# EAGLE design Bubble_Display_Controller (EAGLE 6.5.0)
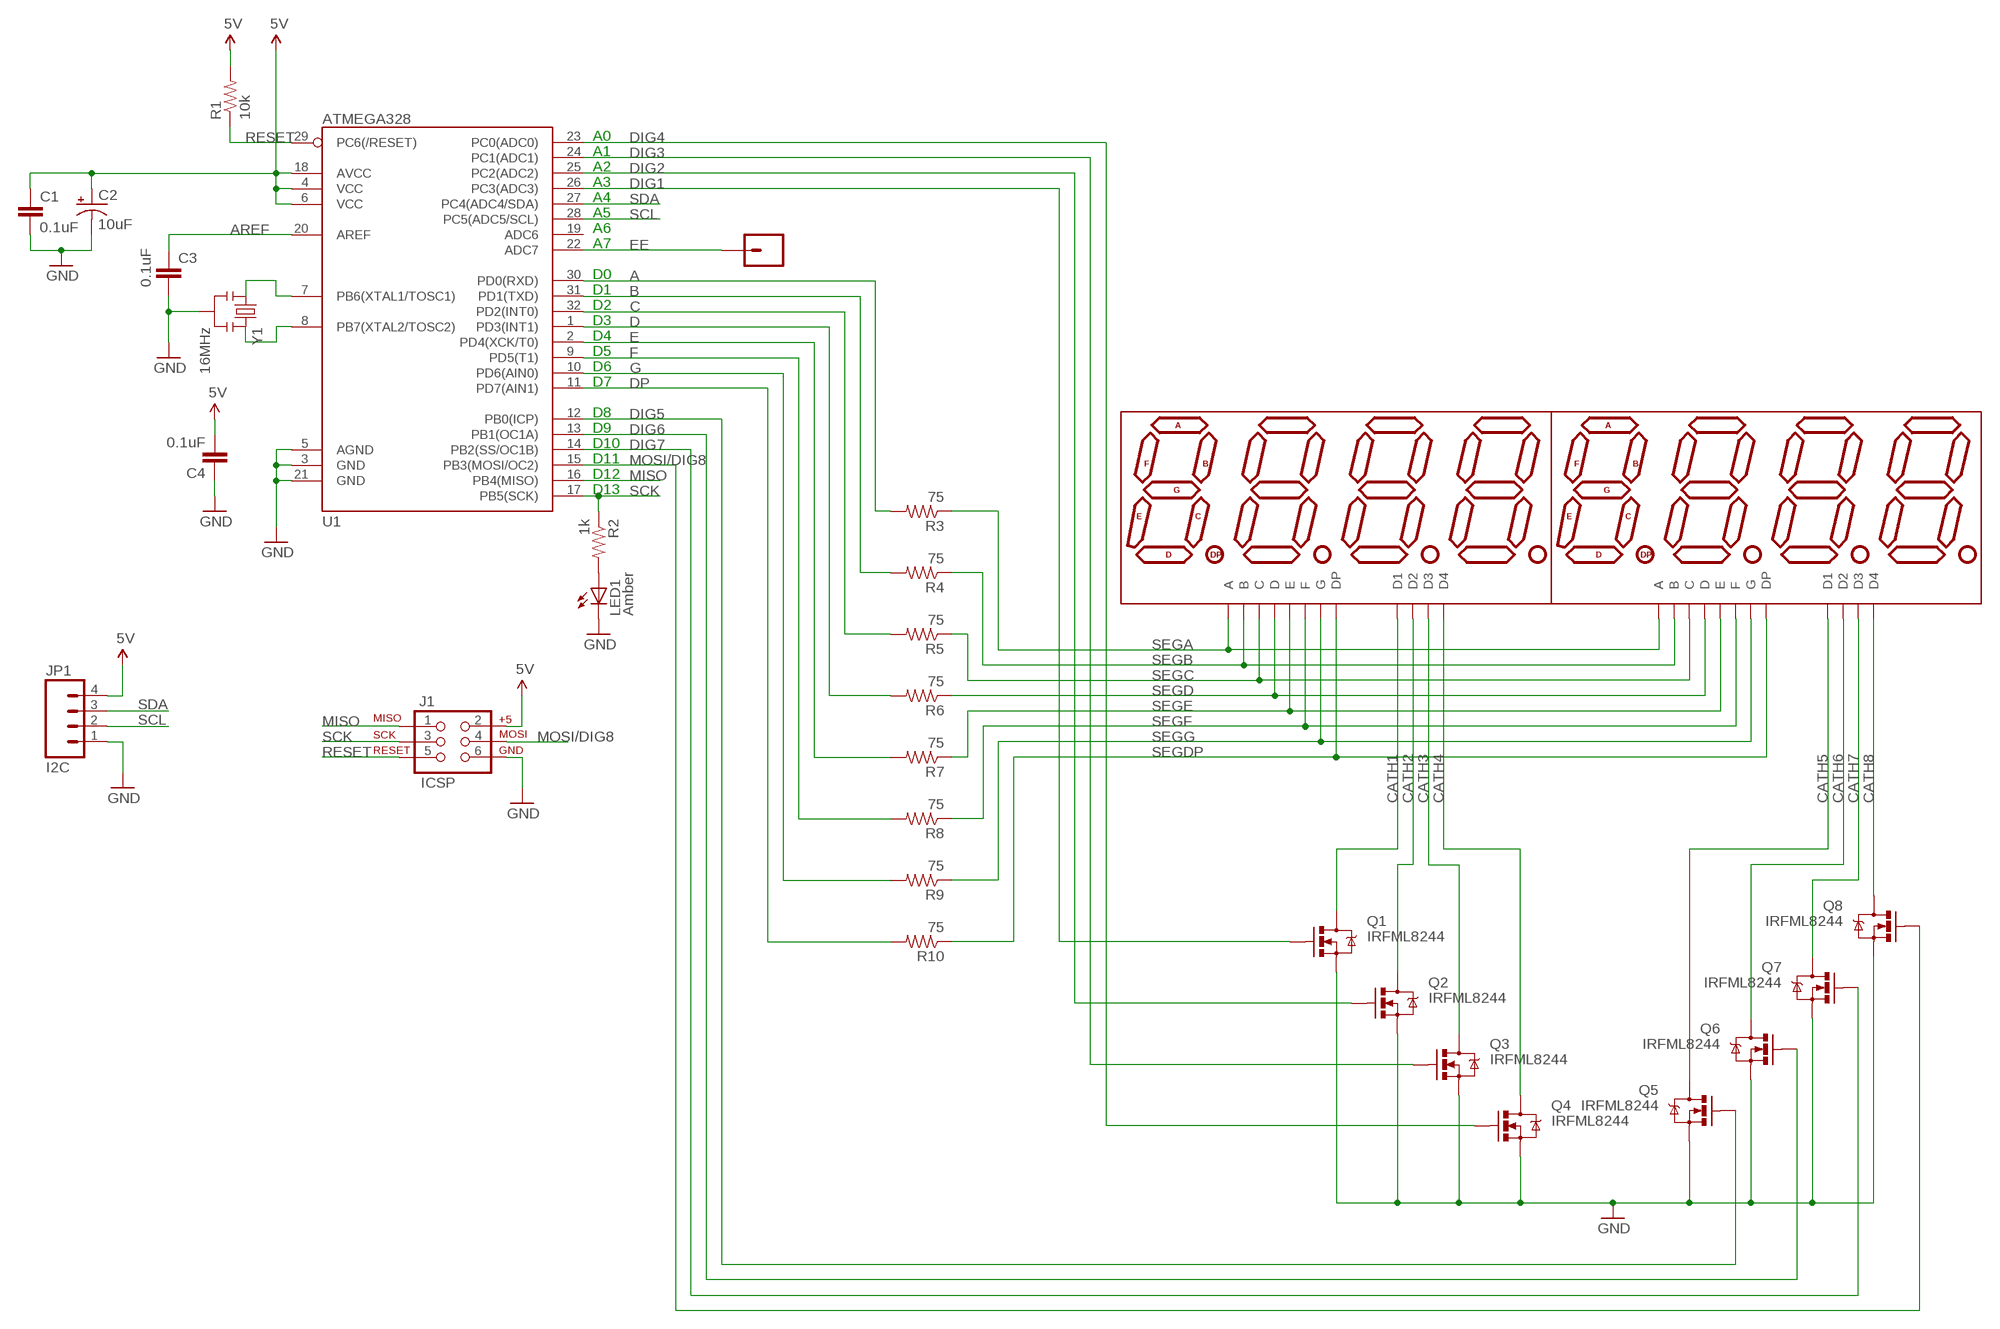
[diagram p0: schematic, sheet 1]

## Parts
C1  0.1uF  CAP0805  [0805]
C2  10uF  CAP_POL0805  [0805-POL]
C3  0.1uF  CAP0805  [0805]
C4  0.1uF  CAP0805  [0805]
DISPLAY1  hp  7-SEGMENT-4DIGIT-COUNTER-HP-BUBBLE  [DIL12]
DISPLAY2  hp  7-SEGMENT-4DIGIT-COUNTER-HP-BUBBLE  [DIL12]
J1  ICSP  AVR_SPI_PRG_6PTH  [2X3]
JP1  I2C  M04PTH  [1X04]
JP2  BREADBD_VIA  [BBD-VIA]
LED1  Amber  LED-0805  [0805-LED]
Q1  IRFML8244  MOSFET-NCHANNELBSS123LT1G  [SOT23]
Q2  IRFML8244  MOSFET-NCHANNELBSS123LT1G  [SOT23]
Q3  IRFML8244  MOSFET-NCHANNELBSS123LT1G  [SOT23]
Q4  IRFML8244  MOSFET-NCHANNELBSS123LT1G  [SOT23]
Q5  IRFML8244  MOSFET-NCHANNELBSS123LT1G  [SOT23]
Q6  IRFML8244  MOSFET-NCHANNELBSS123LT1G  [SOT23]
Q7  IRFML8244  MOSFET-NCHANNELBSS123LT1G  [SOT23]
Q8  IRFML8244  MOSFET-NCHANNELBSS123LT1G  [SOT23]
R1  10k  RESISTOR0805-RES  [0805]
R2  1k  RESISTOR0805-RES  [0805]
R3  75  RESISTOR0805-RES  [0805]
R4  75  RESISTOR0805-RES  [0805]
R5  75  RESISTOR0805-RES  [0805]
R6  75  RESISTOR0805-RES  [0805]
R7  75  RESISTOR0805-RES  [0805]
R8  75  RESISTOR0805-RES  [0805]
R9  75  RESISTOR0805-RES  [0805]
R10  75  RESISTOR0805-RES  [0805]
U1  ATMEGA328  ATMEGA168  [TQFP32-08]
Y1  16MHz  RESONATORSMD  [RESONATOR-SMD]

## Nets
5V: C1.1 C2.1(+) C4.2 J1.2 JP1.4 R1.2 U1.4(VCC) U1.6(VCC) U1.18(AVCC)
A: R3.2 U1.30(PD0(RXD))
AREF: C3.1 U1.20(AREF)
B: R4.2 U1.31(PD1(TXD))
C: R5.2 U1.32(PD2(INT0))
CATH1: DISPLAY1.1(D1) Q1.3(D)
CATH2: DISPLAY1.10(D2) Q2.3(D)
CATH3: DISPLAY1.4(D3) Q3.3(D)
CATH4: DISPLAY1.6(D4) Q4.3(D)
CATH5: DISPLAY2.1(D1) Q5.3(D)
CATH6: DISPLAY2.10(D2) Q6.3(D)
CATH7: DISPLAY2.4(D3) Q7.3(D)
CATH8: DISPLAY2.6(D4) Q8.3(D)
D: R6.2 U1.1(PD3(INT1))
DIG1: Q1.1(G) U1.26(PC3(ADC3))
DIG2: Q2.1(G) U1.25(PC2(ADC2))
DIG3: Q3.1(G) U1.24(PC1(ADC1))
DIG4: Q4.1(G) U1.23(PC0(ADC0))
DIG5: Q5.1(G) U1.12(PB0(ICP))
DIG6: Q6.1(G) U1.13(PB1(OC1A))
DIG7: Q7.1(G) U1.14(PB2(SS/OC1B))
DP: R10.2 U1.11(PD7(AIN1))
E: R7.2 U1.2(PD4(XCK/T0))
EE: JP2.P$1 U1.22(ADC7)
F: R8.2 U1.9(PD5(T1))
G: R9.2 U1.10(PD6(AIN0))
GND: C1.2 C2.2(-) C3.2 C4.1 J1.6 JP1.1 LED1.C Q1.2(S) Q2.2(S) Q3.2(S) Q4.2(S) Q5.2(S) Q6.2(S) Q7.2(S) Q8.2(S) U1.3(GND) U1.5(AGND) U1.21(GND) Y1.2
MISO: J1.1 U1.16(PB4(MISO))
MOSI/DIG8: J1.4 Q8.1(G) U1.15(PB3(MOSI/OC2))
N$1: LED1.A R2.2
N$3: U1.7(PB6(XTAL1/TOSC1)) Y1.1
N$4: U1.8(PB7(XTAL2/TOSC2)) Y1.3
RESET: J1.5 R1.1 U1.29(PC6(/RESET))
SCK: J1.3 R2.1 U1.17(PB5(SCK))
SCL: JP1.2 U1.28(PC5(ADC5/SCL))
SDA: JP1.3 U1.27(PC4(ADC4/SDA))
SEGA: DISPLAY1.12(A) DISPLAY2.12(A) R3.1
SEGB: DISPLAY1.11(B) DISPLAY2.11(B) R4.1
SEGC: DISPLAY1.3(C) DISPLAY2.3(C) R5.1
SEGD: DISPLAY1.8(D) DISPLAY2.8(D) R6.1
SEGDP: DISPLAY1.5(DP) DISPLAY2.5(DP) R10.1
SEGE: DISPLAY1.2(E) DISPLAY2.2(E) R7.1
SEGF: DISPLAY1.9(F) DISPLAY2.9(F) R8.1
SEGG: DISPLAY1.7(G) DISPLAY2.7(G) R9.1
Unconnected: U1.19(ADC6)

## Notes on the sheet
- A0
- A1
- A2
- A3
- A4
- A5
- A6
- A7
- D0
- D1
- D2
- D3
- D4
- D5
- D6
- D7
- D8
- D9
- D10
- D11
- D12
- D13

## Library data of the parts
C1 C3 C4 = SparkFun-Capacitors:CAP: Capacitor Standard 0603 ceramic capacitor, and 0.1" leaded capacitor.
C2 = ChipsParts:CAP_POL
DISPLAY1 DISPLAY2 = SparkFun-Displays:7-SEGMENT-4DIGIT-COUNTER
J1 = SparkFun:AVR_SPI_PRG_6: AVR ISP 6 Pin This is the reduced ISP connector for AVR programming. Common on Arduino. This footprint will take up less PCB space and can be used with a 10-pin to 6-pin adapter such as SKU: BOB-08508
JP1 = SparkFun-Connectors:M04: Header 4 Standard 4-pin 0.1" header. Use with straight break away headers (SKU : PRT-00116), right angle break away headers (PRT-00553), swiss pins (PRT-00743), machine pins (PRT-00117), and female headers (PRT-00115). Molex polarized connector foot print use with SKU : PRT-08231 with associated crimp pins and housings. 1MM SMD Version SKU: PRT-10208
JP2 = ChipsParts:BREADBD_VIA: Connector, hole, via-sized, for test pt or green-wire mod
LED1 = ChipsParts:LED: Generic LED in 0805 package. Both package and symbol copied from SparkFun libraries but they don't have a component LED in 0805.
Q1-Q8 = SparkFun-DiscreteSemi:MOSFET-NCHANNEL: Common NMOSFET Parts MFG P/N Store ID Prod ID FDD8780 TRANS-09984 SI7820DN TRANS-11055 FDS6630A IC-08089 2N7002PW TRANS-11151 FQP30N06L COM-10213 TRANS-10060 BSS123LT1G TRANS-08345 BSS138 TRANS-00830 BS170 2N7000; PROD_ID: TRANS-08345
R1-R10 = SparkFun-Resistors:RESISTOR: Resistor Basic schematic elements and footprints for 0603, 1206, and PTH resistors.
U1 = SparkFun:ATMEGA168
Y1 = SparkFun-FreqCtrl:RESONATOR: Resonator Small SMD resonator. This is the itty bitty 10/20MHz resonators with built in caps. CSTCE10M0G55 and CSTCE20M0V53. Footprint has been reviewed closely but hasn't been tested yet.

## Net classes
0 default: width 0.152 mm, drill 0.305 mm, clearance 0.152 mm

## Board
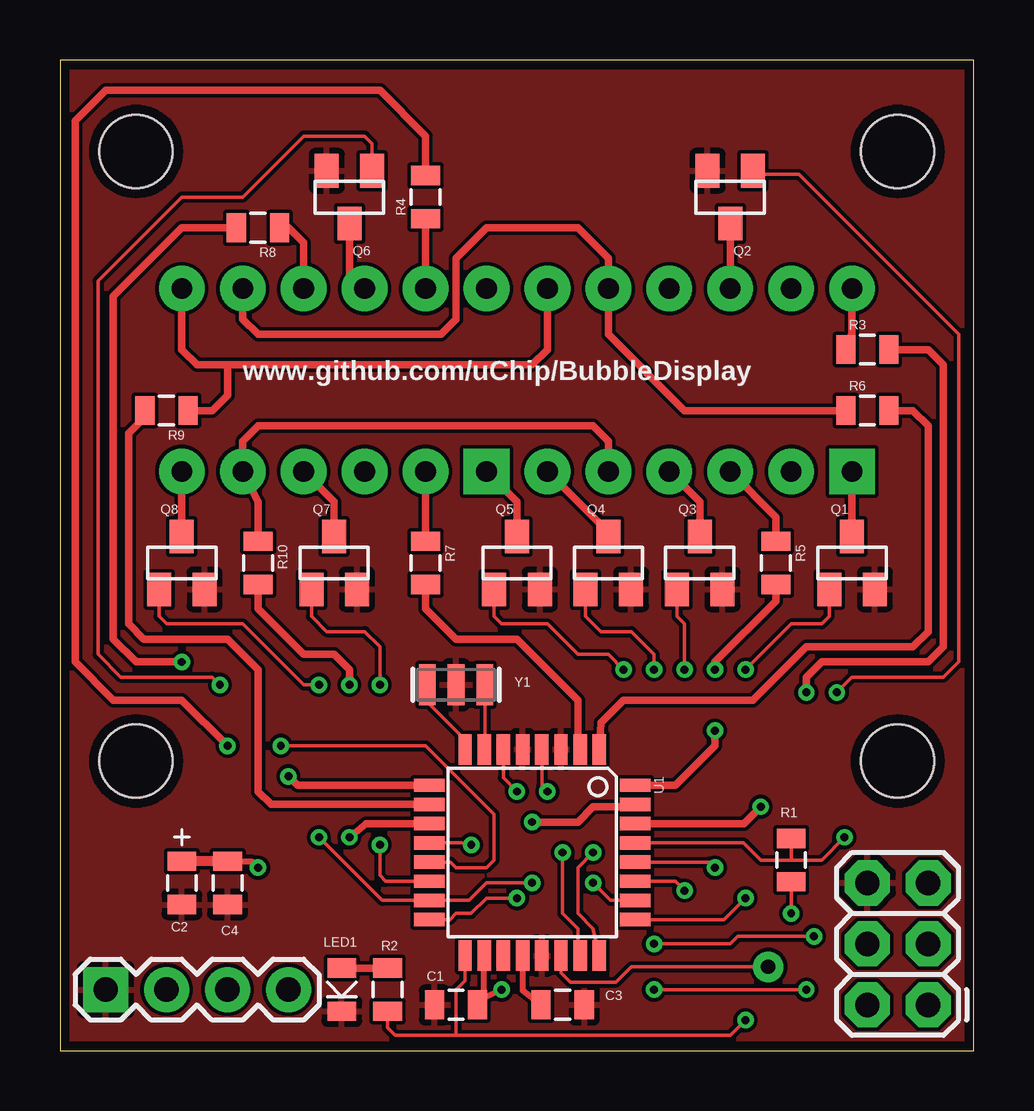
[diagram p1: board, top side]
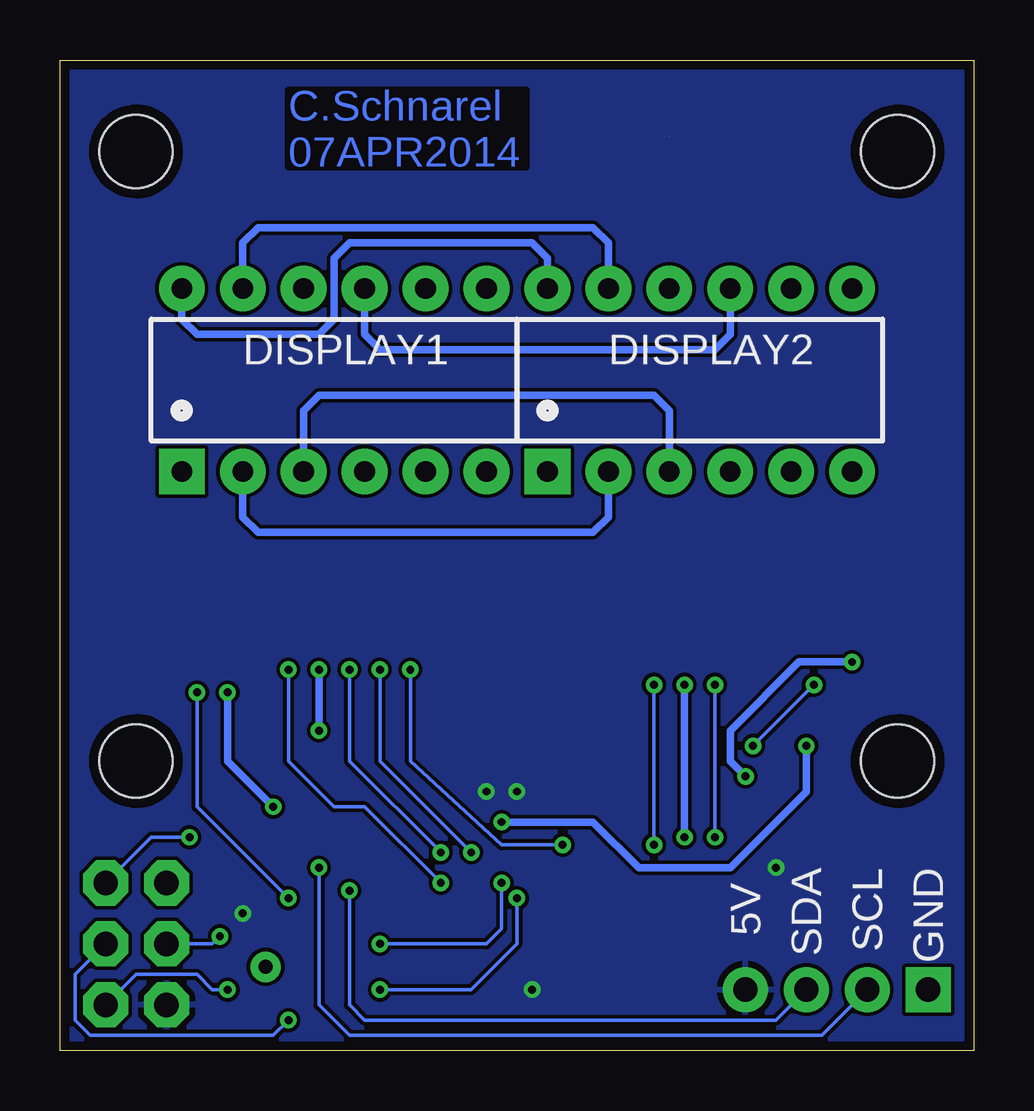
[diagram p2: board, bottom side, seen from below]

Size 38.1 x 41.27 mm. Coordinates in mm from the lower left corner, seen from the top.
Outline: 0,0 38.1,0 38.1,41.27 0,41.27 0,0
Copper layers (1*16): Top 0.0356mm / dielectric 1.5011mm / Bottom 0.0356mm
Design rules "LaenPCBOrder": minimum track width 6mil, minimum drill 13mil, track to track 6mil, track to pad 6mil, pad to pad 6mil, via to via 6mil, smd to smd 6mil, copper to edge 15mil, drill to drill 6mil, minimum pad ring 7mil, minimum via ring 7mil, stop-mask expansion 4mil, vias tented up to drill 0mil, thermal gap 10mil

### Footprints (pad centres in the part's own frame; a part is rotated, then mirrored left to right if it is on the bottom)
0805 = smd 0.8 x 1.2: 1 -0.9,0; 2 0.9,0
0805-POL = smd 0.8 x 1.2: 1 -0.9,0; 2 0.9,0
DIL12 = drill 0.864 pad 1.905 square: 1 -6.35,-3.81 | drill 0.864 pad 1.905: 2 -3.81,-3.81; 3 -1.27,-3.81; 4 1.27,-3.81; 5 3.81,-3.81; 6 6.35,-3.81; 7 6.35,3.81; 8 3.81,3.81; 9 1.27,3.81; 10 -1.27,3.81; 11 -3.81,3.81; 12 -6.35,3.81
2X3 = drill 1.016 pad 1.88 octagon: 1 0,0; 2 0,2.54; 3 2.54,0; 4 2.54,2.54; 5 5.08,0; 6 5.08,2.54
1X04 = drill 1.016 pad 1.88 square: 1 0,0 | drill 1.016 pad 1.88: 2 2.54,0; 3 5.08,0; 4 7.62,0
BBD-VIA = drill 0.6 pad 1.27: P$1 0,0
0805-LED = smd 0.8 x 1.2: A -0.9,0; C 0.9,0
SOT23 = smd 1 x 1.4: 1 -0.95,-1.1; 2 0.95,-1.1; 3 0,1.1
TQFP32-08 = smd 1.27 x 0.559: 1 -4.293,2.8; 2 -4.293,2; 3 -4.293,1.2; 4 -4.293,0.4; 5 -4.293,-0.4; 6 -4.293,-1.2; 7 -4.293,-2; 8 -4.293,-2.8; 17 4.293,-2.8; 18 4.293,-2; 19 4.293,-1.2; 20 4.293,-0.4; 21 4.293,0.4; 22 4.293,1.2; 23 4.293,2; 24 4.293,2.8 | smd 0.559 x 1.27: 9 -2.8,-4.293; 10 -2,-4.293; 11 -1.2,-4.293; 12 -0.4,-4.293; 13 0.4,-4.293; 14 1.2,-4.293; 15 2,-4.293; 16 2.8,-4.293; 25 2.8,4.293; 26 2,4.293; 27 1.2,4.293; 28 0.4,4.293; 29 -0.4,4.293; 30 -1.2,4.293; 31 -2,4.293; 32 -2.8,4.293
STAND-OFF-TIGHT = hole 3.048: 0,0
RESONATOR-SMD = smd 0.7 x 1.7: 1 -1.2,0; 2 0,0; 3 1.2,0

### Placement (x,y rotation side)
C1  16.51,1.91 180 top
C2  5.08,6.99 270 top
C3  20.95,1.91 0 top
C4  6.99,6.99 90 top
DISPLAY1  26.67,27.94 0 bottom
DISPLAY2  11.43,27.94 0 bottom
J1  36.2,1.91 90 top
JP1  1.91,2.54 0 top
JP2  29.53,3.49 0 top
LED1  11.75,2.54 270 top
Q1  33.02,20.32 0 top
Q2  27.94,35.56 180 top
Q3  26.67,20.32 0 top
Q4  22.86,20.32 0 top
Q5  19.05,20.32 0 top
Q6  12.06,35.56 180 top
Q7  11.43,20.32 0 top
Q8  5.08,20.32 0 top
R1  30.48,7.94 270 top
R2  13.65,2.54 90 top
R3  33.66,29.21 0 top
R4  15.24,35.56 90 top
R5  29.84,20.32 270 top
R6  33.66,26.67 0 top
R7  15.24,20.32 270 top
R8  8.26,34.29 180 top
R9  4.45,26.67 180 top
R10  8.26,20.32 270 top
U1  19.68,8.26 270 top
U$5  [STAND-OFF-TIGHT]  3.17,37.47 0 top
U$6  [STAND-OFF-TIGHT]  34.92,37.47 0 top
U$7  [STAND-OFF-TIGHT]  34.92,12.06 0 top
U$8  [STAND-OFF-TIGHT]  3.17,12.06 0 top
Y1  16.51,15.24 180 top

### Tracks (layer width: path | path; a pad name or v marks a point on that pad's centre or on a via)
5V  (via drill 0.33)
  Top 0.152: U1.4 20.09,11.03 v20.32,10.79 | U1.6 18.48,11.36 v19.05,10.79 | R1.2 v30.48,5.71 | 17.68,2.27 C1.1
  Top 0.254: C4.2 7.99,7.88 v8.26,7.62 | 17.68,2.27 U1.18 | v18.41,2.54 17.73,2.22 C1.1
  Top 0.406: C4.2 C2.1
  pour Bottom: 0,0 0,41.27 38.1,41.27 38.1,0
A  (via drill 0.33)
  Top 0.305: v31.11,14.92 31.11,15.56 31.75,16.19 36.2,16.19 36.83,16.83 36.83,28.57 36.2,29.21 R3.2 | U1.30 28.5,9.46 v29.21,10.16
  Bottom 0.305: v29.21,10.16 31.11,12.06 v31.11,14.92
AREF
  Top 0.254: U1.20 19.29,2.51 C3.1
B  (via drill 0.33)
  Top 0.152: U1.31 23.88,10.16
  Top 0.305: v6.99,12.7 5.08,14.61 2.22,14.61 0.64,16.19 0.64,38.73 1.91,40.01 13.34,40.01 15.24,38.1 R4.2 | 23.88,10.16 22.23,10.16 21.59,9.53 v19.68,9.53
  Bottom 0.305: v19.68,9.53 15.88,9.53 13.97,7.62 10.16,7.62 6.99,10.79 v6.99,12.7
C  (via drill 0.33)
  Top 0.254: U1.32 24.39,11.05
  Top 0.305: v27.3,13.34 27.3,12.7 25.66,11.05 24.39,11.05 | v27.3,15.88 27.3,16.19 29.84,18.73 R5.2
  Bottom 0.305: v27.3,13.34 v27.3,15.88
CATH1
  Top 0.305: DISPLAY1.1 Q1.3
CATH2
  Top 0.305: DISPLAY1.10 Q2.3
CATH3
  Top 0.305: DISPLAY1.4 26.67,22.86 Q3.3
CATH4
  Top 0.254: 22.65,21.42 22.65,21.8
  Top 0.305: 22.65,21.42 Q4.3 | 22.65,21.8 DISPLAY1.6
CATH5
  Top 0.305: DISPLAY2.1 19.05,22.86 Q5.3
CATH6
  Top 0.305: Q6.3 12.06,32.38 DISPLAY2.10
CATH7
  Top 0.305: DISPLAY2.4 11.43,22.86 Q7.3
CATH8
  Top 0.305: Q8.3 DISPLAY2.6
D
  Top 0.305: U1.1 22.54,13.65 23.5,14.61 28.89,14.61 31.11,16.83 35.56,16.83 36.2,17.46 36.2,26.04 35.56,26.67 R6.2
DIG1  (via drill 0.33)
  Top 0.152: U1.26 22.95,6.25 v22.23,6.99 | v28.57,15.88 30.48,17.78 31.75,17.78 32.07,18.1 Q1.1
  Bottom 0.152: v22.23,6.99 25.4,10.16 26.67,10.16 28.57,12.06 v28.57,15.88
DIG2  (via drill 0.33)
  Top 0.152: v32.38,14.92 33.02,15.56 36.83,15.56 37.47,16.19 37.47,29.84 36.2,31.11 30.8,36.51 29.04,36.51 Q2.1 | U1.25 27.68,5.46 v28.57,6.35
  Bottom 0.152: v28.57,6.35 32.38,10.16 v32.38,14.92
DIG3  (via drill 0.33)
  Top 0.152: U1.24 22.23,5.08 21.59,5.71 21.59,7.62 v22.23,8.26 | Q3.1 25.72,18.09 26.04,17.78 v26.04,15.88
  Bottom 0.152: v22.23,8.26 26.04,12.06 v26.04,15.88
DIG4  (via drill 0.33)
  Top 0.152: v24.77,15.88 24.77,16.51 23.81,17.46 22.54,17.46 21.91,18.09 Q4.1 | v20.95,8.26 20.95,5.71 21.59,5.08 21.59,4.06 U1.23
  Bottom 0.152: v20.95,8.26 24.77,12.06 v24.77,15.88
DIG5  (via drill 0.33)
  Top 0.152: Q5.1 18.1,18.09 18.41,17.78 20.32,17.78 21.59,16.51 22.86,16.51 v23.5,15.88 | U1.12 16.75,8.65 v17.14,8.57
  Bottom 0.152: v17.14,8.57 19.68,8.57 23.5,12.06 v23.5,15.88
DIG6  (via drill 0.33)  (1 unrouted)
  Top 0.152: 12.7,38.1 12.38,38.1 10.16,38.1 7.62,35.56 5.08,35.56 1.59,32.07 1.59,16.51 2.54,15.56 6.35,15.56 v6.67,15.24 | v9.21,12.7 15.24,12.7 18.1,9.84 18.1,7.94 17.78,7.62 16.51,7.62 16.27,7.86 U1.13 | Q6.1 13.02,37.78 12.7,38.1
  Bottom 0.152: v9.21,12.7 v6.67,15.24
DIG7  (via drill 0.33)
  Top 0.152: v13.34,15.24 13.34,16.83 12.7,17.46 11.11,17.46 10.48,18.09 Q7.1 | U1.14 13.58,7.05 13.34,7.3 v13.34,8.57
  Bottom 0.152: v13.34,8.57 v13.34,15.24
DP  (via drill 0.33)
  Top 0.305: U1.11 12.77,9.46 v12.06,8.89 | R10.2 8.26,18.41 8.89,17.78 10.16,16.51 11.43,16.51 12.06,15.88 v12.06,15.24
  Bottom 0.305: v12.06,8.89 v12.06,15.24
E
  Top 0.254: 21.59,12.64 U1.2
  Top 0.305: R7.2 15.24,18.41 16.51,17.14 19.05,17.14 21.59,14.61 21.59,12.64
EE
  Top 0.152: U1.22 20.89,3.25 21.27,2.86 23.18,2.86 23.81,3.49 JP2.P$1
F  (via drill 0.33)
  Top 0.305: v5.08,16.19 3.17,16.19 2.22,17.14 2.22,31.43 5.08,34.29 R8.2 | U1.9 9.9,11.05 v9.53,11.43
  Bottom 0.305: v9.53,11.43 10.16,12.06 10.16,13.34 7.3,16.19 v5.08,16.19
G
  Top 0.305: U1.10 8.79,10.26 8.26,10.79 8.26,15.88 6.99,17.14 3.49,17.14 2.86,17.78 2.86,25.72 3.54,26.41 R9.2
GND
  pour Top: 0,0 0,41.27 38.1,41.27 38.1,0
MISO  (via drill 0.33)
  Top 0.152: U1.16 16.25,5.46 16.51,5.71 17.14,5.71 17.78,6.35 v19.05,6.35 | v31.11,2.54 v24.77,2.54
  Bottom 0.152: v19.05,6.35 19.05,4.45 20.95,2.54 v24.77,2.54 | J1.1 34.92,3.17 32.38,3.17 31.75,2.54 v31.11,2.54
MOSI/DIG8  (via drill 0.33)
  Top 0.152: v10.79,15.24 10.16,15.24 7.62,17.78 4.45,17.78 4.13,18.09 Q8.1 | v24.77,4.45 27.94,4.45 28.26,4.76 v31.43,4.76 | v19.68,6.99 17.78,6.99 17.05,6.25 U1.15 13.43,6.25 v10.79,8.89
  Bottom 0.152: v10.79,15.24 v10.79,8.89 | v19.68,6.99 19.68,5.08 20.32,4.45 v24.77,4.45 | v31.43,4.76 31.75,4.45 J1.4
N$1
  Top 0.305: R2.2 LED1.A
N$3
  Top 0.152: Y1.1 17.71,12.57 U1.7
N$4
  Top 0.152: U1.8 16.89,12.96 15.31,14.54 Y1.3
RESET  (via drill 0.33)
  Top 0.152: 30.48,7.94 29.21,7.94 28.49,8.65 U1.29 | 30.48,7.94 31.75,7.94 v32.7,8.89 | R1.1 30.48,7.94
  Bottom 0.152: v32.7,8.89 34.29,8.89 J1.5
SCK  (via drill 0.33)
  Top 0.152: 16.51,0.64 16.51,2.54 16.89,2.92 U1.17 16.73,3.81 | 16.51,0.64 27.94,0.64 v28.57,1.27 | R2.1 13.65,0.95 13.97,0.64 16.51,0.64
  Bottom 0.152: J1.3 37.47,3.17 37.47,1.27 36.83,0.64 29.21,0.64 v28.57,1.27
SCL  (via drill 0.33)
  Top 0.152: U1.28 27.07,7.86 v27.3,7.62
  Bottom 0.152: v27.3,7.62 27.3,1.91 26.04,0.64 6.35,0.64 JP1.2
SDA  (via drill 0.33)
  Top 0.152: U1.27 25.65,7.05 v26.04,6.67
  Bottom 0.152: v26.04,6.67 26.04,1.91 25.4,1.27 8.26,1.27 JP1.3
SEGA
  Top 0.305: DISPLAY1.12 33.02,29.84 R3.1
  Bottom 0.305: DISPLAY2.12 17.78,33.02 18.41,33.66 26.04,33.66 26.67,33.02 26.67,30.48 27.3,29.84 32.38,29.84 33.02,30.48 DISPLAY1.12
SEGB
  Top 0.305: DISPLAY2.11 R4.1
  Bottom 0.305: DISPLAY1.11 30.48,33.66 29.84,34.29 15.88,34.29 15.24,33.66 DISPLAY2.11
SEGC
  Top 0.305: R5.1 29.84,22.23 DISPLAY1.3
  Bottom 0.305: DISPLAY2.3 12.7,26.67 13.34,27.3 27.3,27.3 27.94,26.67 DISPLAY1.3
SEGD
  Top 0.305: DISPLAY2.8 7.62,30.48 8.26,29.84 15.88,29.84 16.51,30.48 16.51,33.02 17.78,34.29 21.59,34.29 22.86,33.02 DISPLAY1.8 22.86,29.84 26.04,26.67 R6.1
SEGDP
  Top 0.305: DISPLAY1.5 22.86,25.4 22.23,26.04 8.26,26.04 7.62,25.4 DISPLAY2.5 8.26,22.86 R10.1
SEGE
  Top 0.305: R7.1 DISPLAY2.2
  Bottom 0.305: DISPLAY2.2 15.24,22.23 15.88,21.59 29.84,21.59 30.48,22.23 DISPLAY1.2
SEGF
  Top 0.305: R8.1 9.53,34.29 10.16,33.66 DISPLAY2.9
  Bottom 0.305: DISPLAY2.9 10.16,29.84 10.79,29.21 24.77,29.21 25.4,29.84 DISPLAY1.9
SEGG
  Top 0.305: DISPLAY2.7 5.08,29.21 5.71,28.57 6.99,28.57 | 6.99,28.57 19.68,28.57 20.32,29.21 DISPLAY1.7 | R9.1 6.35,26.67 6.99,27.3 6.99,28.57

### Text on the board
Bottom: C.Schnarel / 07APR2014
tPlace: www.github.com/uChip/BubbleDisplay
bPlace: GND | SCL | SDA | 5V